# Altium schematic sheet RB_Conn.SchDoc
size 420 x 297 mm; ApprovedBy: UA3REO; Author: RU4PN; CompanyName: Wolf-2; DocumentNumber: R_BOARD - Connectors; Revision: 0.1; SheetNumber: 1; SheetTotal: 3
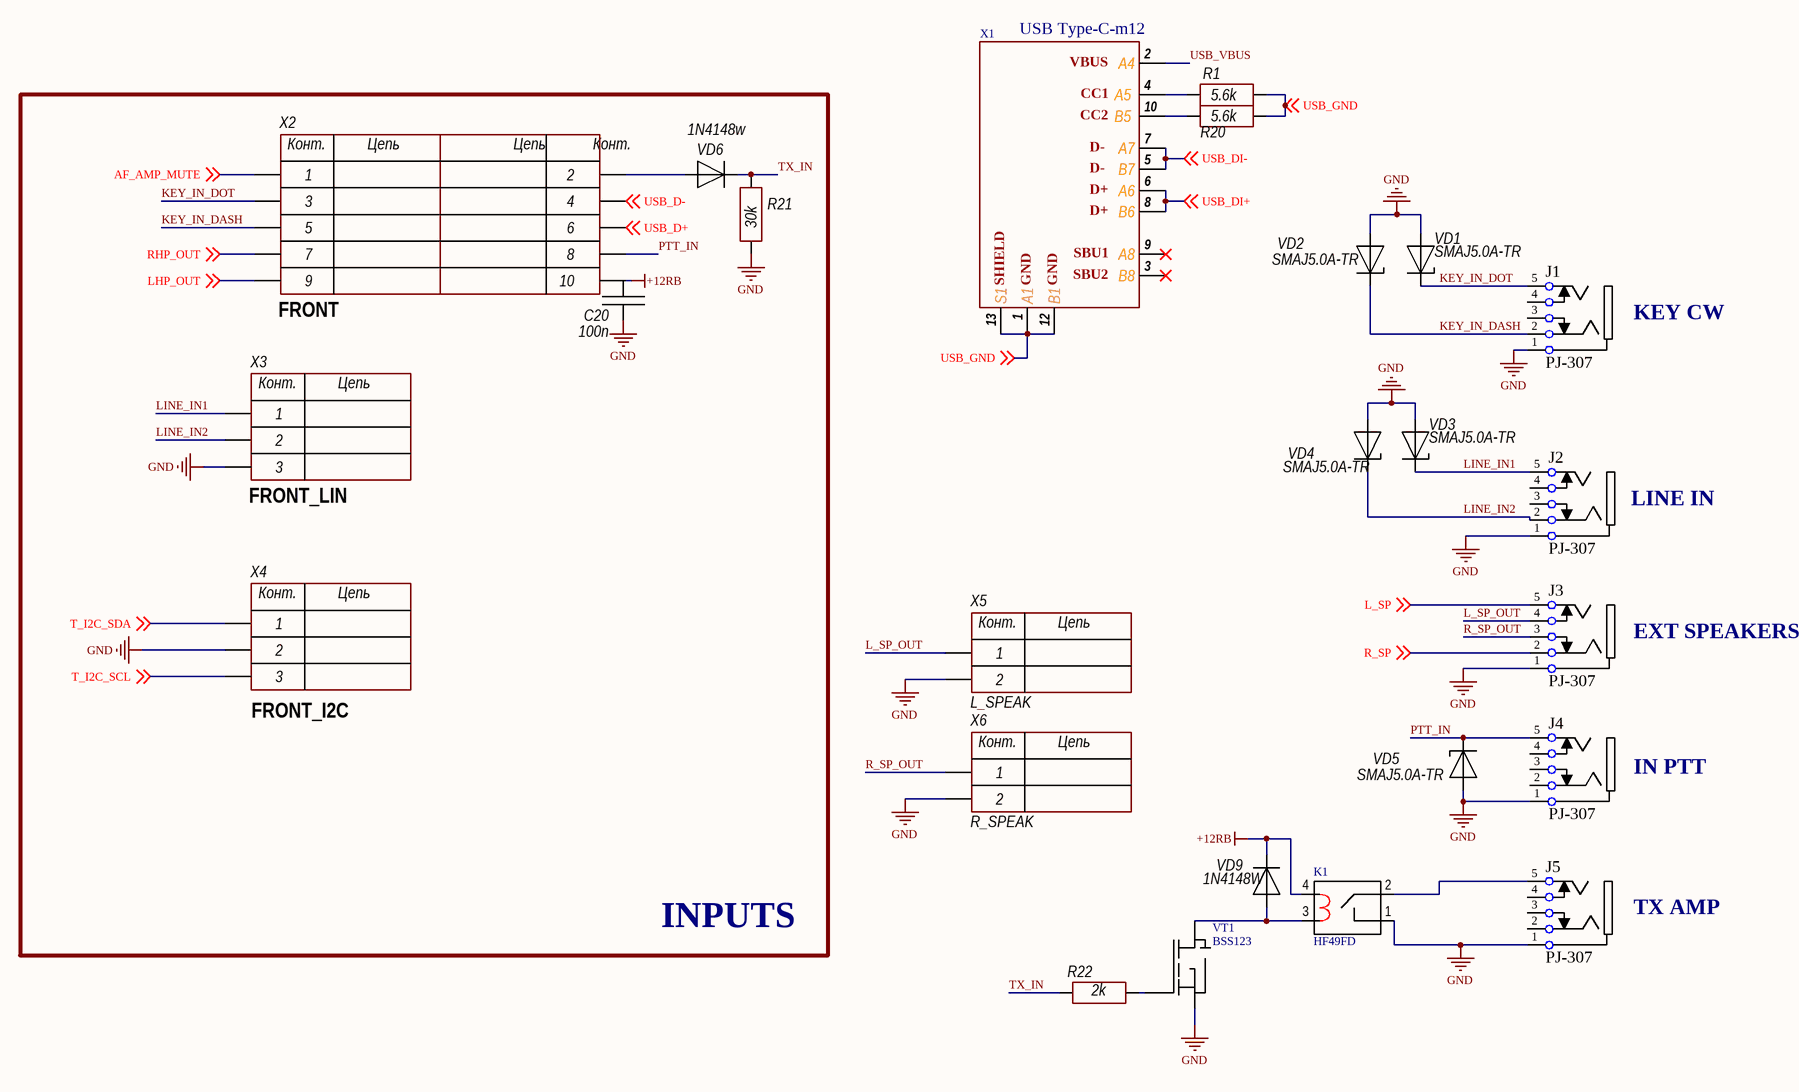
[diagram p0: RB_Conn.SchDoc]

## Parts
C20  100n  [CH0805C]
J1  PJ-307  [PJ-307]
J2  PJ-307  [PJ-307]
J3  PJ-307  [PJ-307]
J4  PJ-307  [PJ-307]
J5  PJ-307  [PJ-307]
K1  HF49FD  [HF49FD]
R1  5.6k  [CH0805R]
R20  5.6k  [CH0805R]
R21  30k  [CH0805R]
R22  2k  [CH0805R]
VD1  SMAJ5.0A-TR  [SMA]
VD2  SMAJ5.0A-TR  [SMA]
VD3  SMAJ5.0A-TR  [SMA]
VD4  SMAJ5.0A-TR  [SMA]
VD5  SMAJ5.0A-TR  [SMA]
VD6  1N4148w  [SOD323]
VD9  1N4148W  [SOD123]
VT1  BSS123  [SOT23_132]
X1  USB Type-C-m12  [PCBComponent_1]
X2  FRONT  [CON: BH-10]
X3  FRONT_LIN  [CON: CWF-3]
X4  FRONT_I2C  [CON: CWF-3]
X5  L_SPEAK  [CON: PLS-2]
X6  R_SPEAK  [CON: PLS-2]

## Blocks framed on the sheet
INPUTS: C20 R21 VD6 X2-X4

## Nets
+12RB: K1.4 VD9.2 X2.10
GND: C20.1 J1.1 J2.1 J3.1 J4.1 J5.1 K1.1 R21.1 VD1.1(A) VD2.1(A) VD3.1(A) VD4.1(A) VD5.1(A) VT1.2(S) X3.3 X4.2 X5.2 X6.2
AF_AMP_MUTE: X2.1 ; off-sheet AF_AMP_MUTE
KEY_IN_DASH: J1.2 VD2.2(C) X2.5
KEY_IN_DOT: J1.5 VD1.2(C) X2.3
L_SP: J3.5 ; off-sheet L_SP
L_SP_OUT: J3.4 X5.1
LHP_OUT: X2.9 ; off-sheet LHP_OUT
LINE_IN1: J2.5 VD3.2(C) X3.1
LINE_IN2: J2.2 VD4.2(C) X3.2
PTT_IN: J4.5 VD5.2(C) X2.8
R_SP: J3.2 ; off-sheet R_SP
R_SP_OUT: J3.3 X6.1
RHP_OUT: X2.7 ; off-sheet RHP_OUT
T_I2C_SCL: X4.3 ; off-sheet T_I2C_SCL
T_I2C_SDA: X4.1 ; off-sheet T_I2C_SDA
TX_IN: R21.2 R22.1 VD6.2
USB_D+: X2.6 ; off-sheet USB_D+
USB_D-: X2.4 ; off-sheet USB_D-
USB_DI+: X1.6(A6) X1.8(B6) ; off-sheet USB_DI+
USB_DI-: X1.5(B7) X1.7(A7) ; off-sheet USB_DI-
USB_GND: R1.2 R20.2 X1.1(A1) X1.12(B1) X1.13(S1) ; off-sheet USB_GND
USB_VBUS: X1.2(A4)
NetJ5_5: J5.5 K1.2
NetK1_3: K1.3 VD9.1 VT1.3(D)
NetR1_1: R1.1 X1.4(A5)
NetR20_1: R20.1 X1.10(B5)
NetR22_2: R22.2 VT1.1(G)
NetVD6_1: VD6.1 X2.2

Not connected (* = marked no-connect by the designer): C20 2; J1 3 4; J2 3 4; J4 2 3 4; J5 2 3 4; X1 3(B8)* 9(A8)*

## Notes on the sheet
- KEY CW
- LINE IN
- EXT SPEAKERS
- IN PTT
- TX AMP
- Перв. примен.
- Справ. №
- Подп. и дата
- Инв. № дубл.
- Взам. инв. №
- Разраб.
- Изм.
- Лист
- № докум.
- Подп.
- Дата
- Лит.
- Масса
- Масштаб
- Пров.
- Т.контр.
- Листов
- Инв. № подл.
- Утв.
- Н.контр.
- 2.106-A3
- Копировал
- Формат А3
- (in symbol 2-Connector) Конт.; Цепь
- (in symbol 3-Connector) Конт.; Цепь
- (in symbol 10(2)-Connector) Конт.; Цепь
- (in symbol USB-C_2.0) VBUS; CC1; CC2; D-; D+; SBU1; SBU2; SHIELD; GND

## Library data of the parts
C20 = Capacitor: Manufacturer: *; Model: *; HelpURL: *; ComponentKind: *; Value: *
J1 = JACK_Audio-3: KEY
J2 = JACK_Audio-3: LIN
J3 = JACK_Audio-3: OUT_SPEAKERS
J4 = JACK_Audio-3: PTT_IN
J5 = JACK_Audio-3: TX
K1 = HF49FD 012-1H12
R1 R20-R22 = Resistor: Manufacturer: *; Model: *; HelpURL: *; ComponentKind: *; Value: *
VD1-VD5 = Diod Zener: ComponentKind: *; Manufacturer: *; Model: *; HelpURL: *
VD6 VD9 = Diod: ComponentKind: *; Manufacturer: *; Model: *; HelpURL: *
X1 = USB-C_2.0
X2 = 10(2)-Connector: Model: *; Manufacturer: *; HelpURL: *; ComponentKind: *
X3 X4 = 3-Connector: Model: *; Manufacturer: *; HelpURL: *; ComponentKind: *
X5 X6 = 2-Connector: Model: *; Manufacturer: *; HelpURL: *; ComponentKind: *